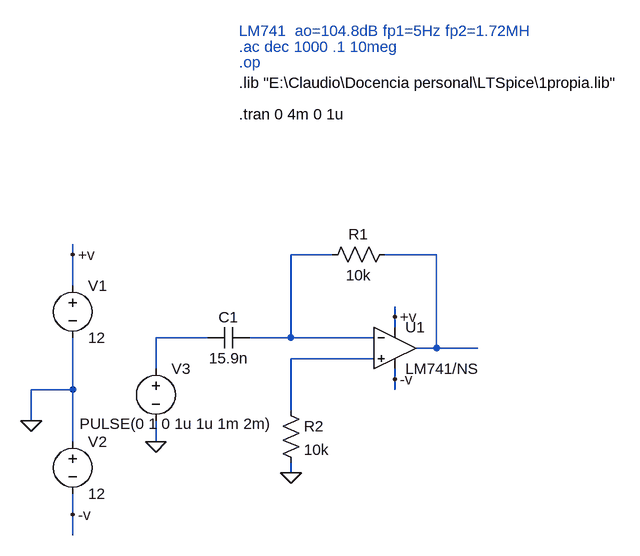
[diagram p0: schematic derivador1.asc]
derivador1.asc, the LTspice schematic file:
Version 4
SHEET 1 880 680
WIRE -208 16 -208 0
WIRE 192 16 128 16
WIRE 352 16 272 16
WIRE -208 64 -208 16
WIRE 288 112 288 96
WIRE 288 128 288 112
WIRE 0 144 -80 144
WIRE 128 144 128 16
WIRE 128 144 64 144
WIRE 256 144 128 144
WIRE 352 160 352 16
WIRE 352 160 320 160
WIRE 416 160 352 160
WIRE 256 176 128 176
WIRE -80 192 -80 144
WIRE 288 208 288 192
WIRE -208 224 -208 144
WIRE -208 224 -272 224
WIRE 288 224 288 208
WIRE 128 256 128 176
WIRE -272 272 -272 224
WIRE -208 304 -208 224
WIRE -80 304 -80 272
WIRE 128 352 128 336
WIRE -208 416 -208 384
WIRE -208 448 -208 416
FLAG -272 272 0
FLAG -208 16 +v
FLAG -208 416 -v
FLAG 288 112 +v
FLAG 288 208 -v
FLAG 128 352 0
FLAG -80 304 0
SYMBOL OpAmps\\opamp2 288 96 R0
SYMATTR InstName U1
SYMATTR Value LM741/NS
SYMBOL voltage -208 48 R0
WINDOW 123 0 0 Left 0
WINDOW 39 0 0 Left 0
SYMATTR InstName V1
SYMATTR Value 12
SYMBOL voltage -208 288 R0
WINDOW 123 0 0 Left 0
WINDOW 39 0 0 Left 0
SYMATTR InstName V2
SYMATTR Value 12
SYMBOL res 288 0 R90
WINDOW 0 0 56 VBottom 2
WINDOW 3 32 56 VTop 2
SYMATTR InstName R1
SYMATTR Value 10k
SYMBOL cap 64 128 R90
WINDOW 0 0 32 VBottom 2
WINDOW 3 32 32 VTop 2
SYMATTR InstName C1
SYMATTR Value 15.9n
SYMBOL res 112 240 R0
SYMATTR InstName R2
SYMATTR Value 10k
SYMBOL voltage -80 176 R0
WINDOW 3 -117 100 Left 2
WINDOW 123 0 0 Left 0
WINDOW 39 0 0 Left 0
SYMATTR Value PULSE(0 1 0 1u 1u 1m 2m)
SYMATTR InstName V3
TEXT 48 -248 Left 2 !.lib "E:\\Claudio\\Docencia personal\\LTSpice\\1propia.lib"
TEXT 48 -280 Left 2 ;.op
TEXT 48 -304 Left 2 ;.ac dec 1000 .1 10meg
TEXT 48 -328 Left 2 ;LM741  ao=104.8dB fp1=5Hz fp2=1.72MH
TEXT 48 -200 Left 2 !.tran 0 4m 0 1u

The netlist it stands for:
* derivador1.asc
XU1 N004 N001 +v -v N002 LM741/NS  ; pins In+ In- V+ V- OUT
V1 +v 0 12
V2 0 -v 12
R1 N002 N001 10k
C1 N001 N003 15.9n
R2 N004 0 10k
V3 N003 0 PULSE(0 1 0 1u 1u 1m 2m)
.lib "E:\Claudio\Docencia personal\LTSpice\1propia.lib"
* .op
* .ac dec 1000 .1 10meg
* LM741  ao=104.8dB fp1=5Hz fp2=1.72MH
.tran 0 4m 0 1u
.backanno
.end